# Altium schematic sheet spartan6-1.SchDoc
size 389 x 250 mm; SheetNumber: 2; SheetTotal: 8
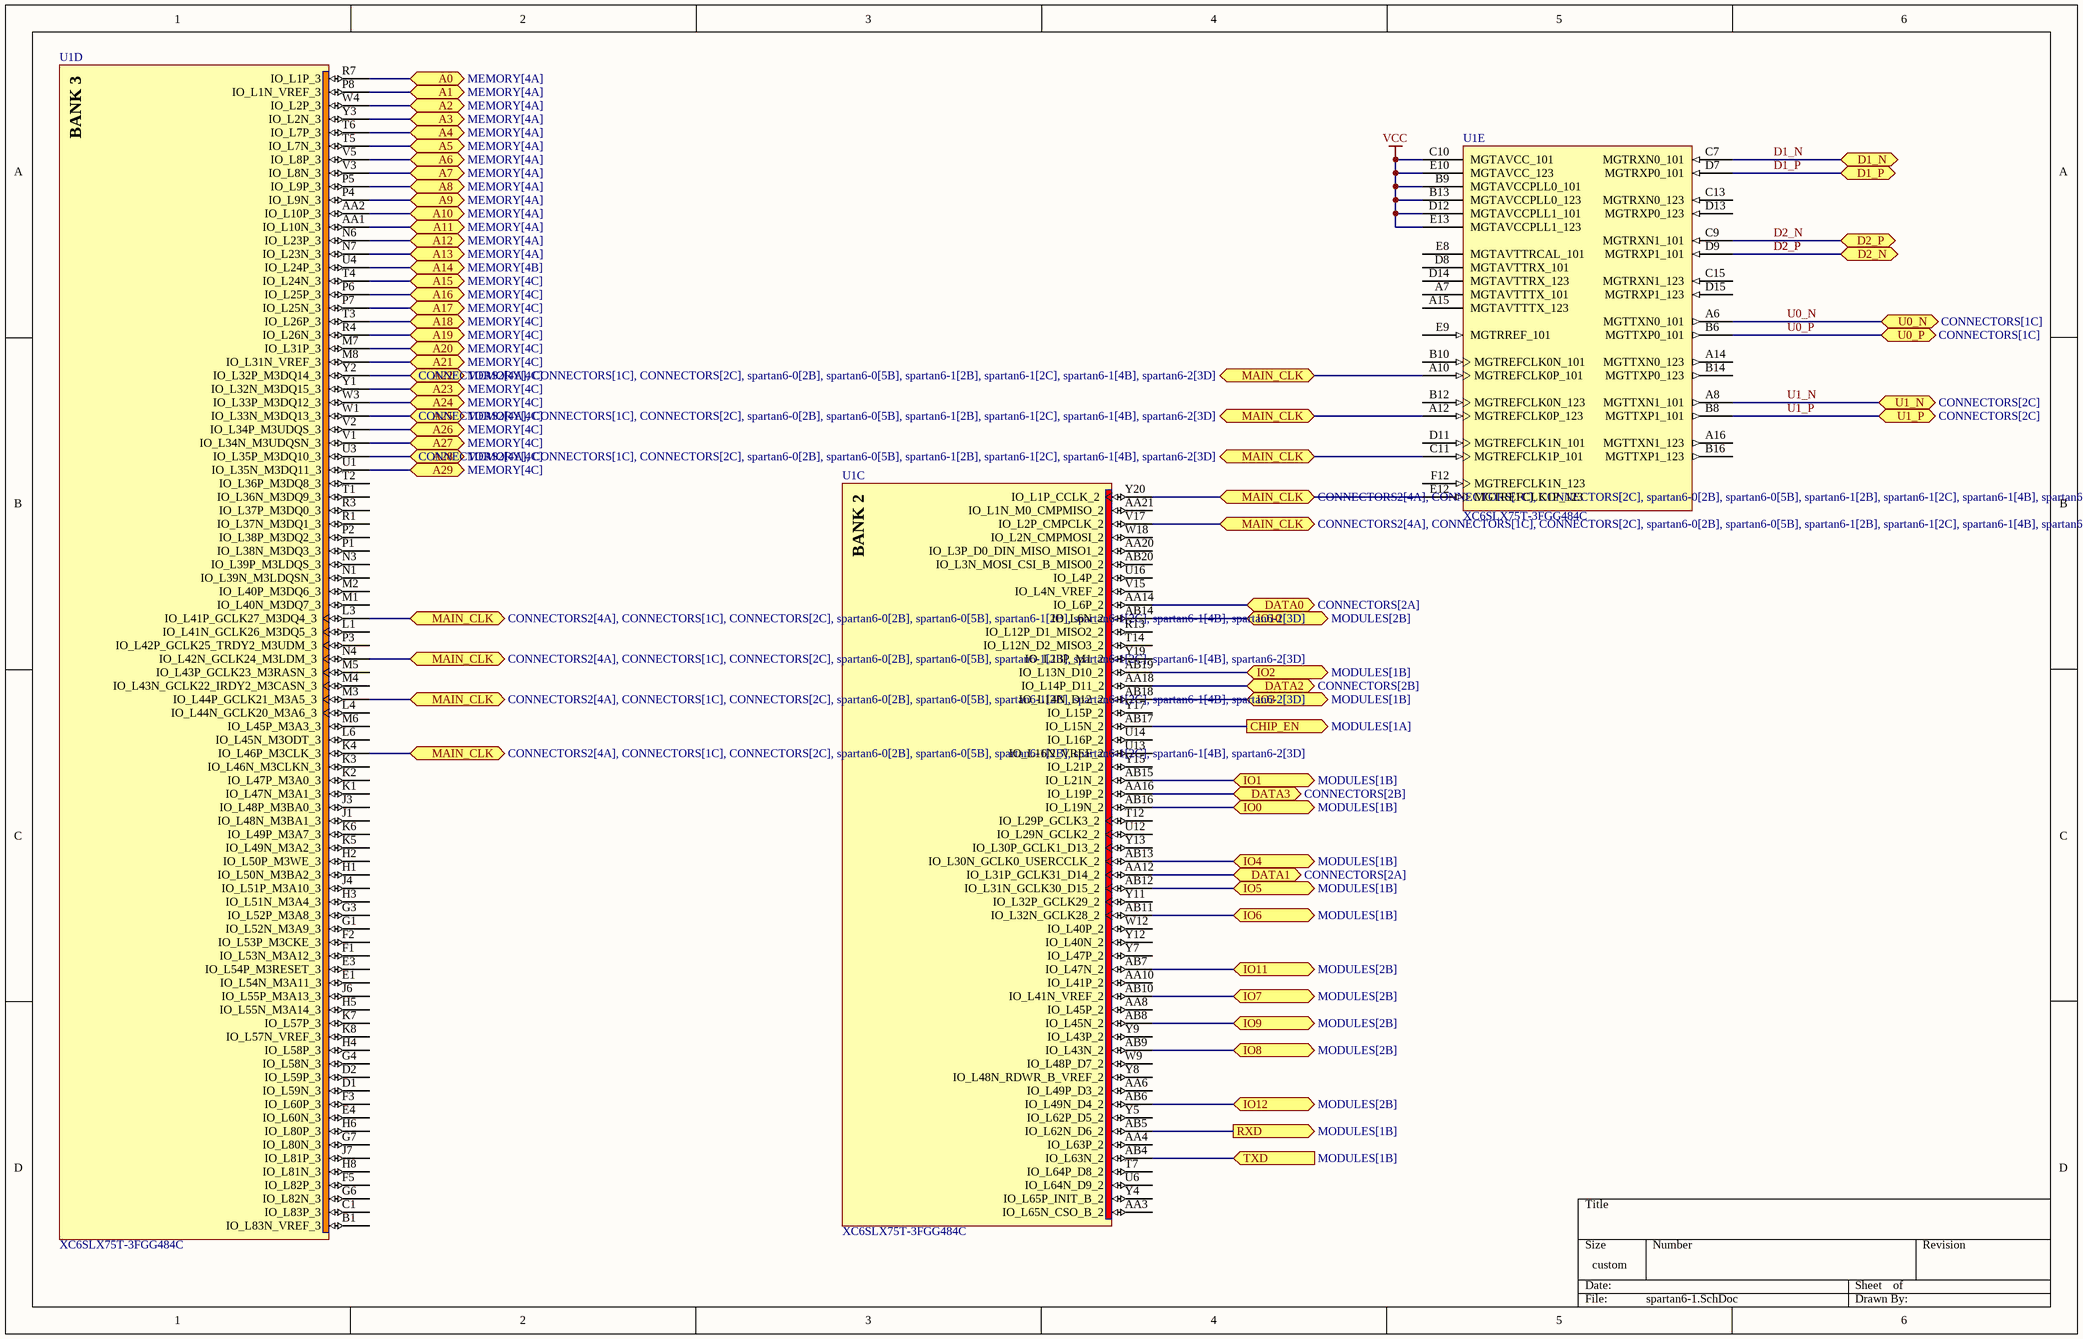
[diagram p0: spartan6-1.SchDoc]

## Parts
U1  XC6SLX75T-3FGG484C  [FGG484]  (parts C,D,E of 9)

## Ports
A0 (bidir, see MEMORY[4A]), A1 (bidir, see MEMORY[4A]), A2 (bidir, see MEMORY[4A]), A3 (bidir, see MEMORY[4A]), A4 (bidir, see MEMORY[4A]), A5 (bidir, see MEMORY[4A]), A6 (bidir, see MEMORY[4A]), A7 (bidir, see MEMORY[4A]), A8 (bidir, see MEMORY[4A]), A9 (bidir, see MEMORY[4A]), A10 (bidir, see MEMORY[4A]), A11 (bidir, see MEMORY[4A]), A12 (bidir, see MEMORY[4A]), A13 (bidir, see MEMORY[4A]), A14 (bidir, see MEMORY[4B]), A15 (bidir, see MEMORY[4C]), A16 (bidir, see MEMORY[4C]), A17 (bidir, see MEMORY[4C]), A18 (bidir, see MEMORY[4C]), A19 (bidir, see MEMORY[4C]), A20 (bidir, see MEMORY[4C]), A21 (bidir, see MEMORY[4C]), A22 (bidir, see MEMORY[4C]), A23 (bidir, see MEMORY[4C]), A24 (bidir, see MEMORY[4C]), A25 (bidir, see MEMORY[4C]), A26 (bidir, see MEMORY[4C]), A27 (bidir, see MEMORY[4C]), A28 (bidir, see MEMORY[4C]), A29 (bidir, see MEMORY[4C]), CHIP_EN (out, see MODULES[1A]), D1_N (bidir), D1_P (bidir), D2_N (bidir), D2_P (bidir), DATA0 (bidir, see CONNECTORS[2A]), DATA1 (bidir, see CONNECTORS[2A]), DATA2 (bidir, see CONNECTORS[2B]), DATA3 (bidir, see CONNECTORS[2B]), IO0 (bidir, see MODULES[1B]), IO1 (bidir, see MODULES[1B]), IO2 (bidir, see MODULES[1B]), IO3 (bidir, see MODULES[1B]), IO4 (bidir, see MODULES[1B]), IO5 (bidir, see MODULES[1B]), IO6 (bidir, see MODULES[1B]), IO7 (bidir, see MODULES[2B]), IO8 (bidir, see MODULES[2B]), IO9 (bidir, see MODULES[2B]), IO10 (bidir, see MODULES[2B]), IO11 (bidir, see MODULES[2B]), IO12 (bidir, see MODULES[2B]), MAIN_CLK (bidir, see CONNECTORS2[4A], CONNECTORS[1C], CONNECTORS[2C], spartan6-0[2B], spartan6-0[5B], spartan6-1[2B], spartan6-1[2C], spartan6-1[4B], spartan6-2[3D]), RXD (out, see MODULES[1B]), TXD (in, see MODULES[1B]), U0_N (bidir, see CONNECTORS[1C]), U0_P (bidir, see CONNECTORS[1C]), U1_N (bidir, see CONNECTORS[2C]), U1_P (bidir, see CONNECTORS[2C])

## Nets
VCC: U1.B9(MGTAVCCPLL0_101) U1.B13(MGTAVCCPLL0_123) U1.C10(MGTAVCC_101) U1.D12(MGTAVCCPLL1_101) U1.E10(MGTAVCC_123) U1.E13(MGTAVCCPLL1_123)
A0: U1.R7(IO_L1P_3) ; port A0
A1: U1.P8(IO_L1N_VREF_3) ; port A1
A2: U1.W4(IO_L2P_3) ; port A2
A3: U1.Y3(IO_L2N_3) ; port A3
A4: U1.T6(IO_L7P_3) ; port A4
A5: U1.T5(IO_L7N_3) ; port A5
A6: U1.V5(IO_L8P_3) ; port A6
A7: U1.V3(IO_L8N_3) ; port A7
A8: U1.P5(IO_L9P_3) ; port A8
A9: U1.P4(IO_L9N_3) ; port A9
A10: U1.AA2(IO_L10P_3) ; port A10
A11: U1.AA1(IO_L10N_3) ; port A11
A12: U1.N6(IO_L23P_3) ; port A12
A13: U1.N7(IO_L23N_3) ; port A13
A14: U1.U4(IO_L24P_3) ; port A14
A15: U1.T4(IO_L24N_3) ; port A15
A16: U1.P6(IO_L25P_3) ; port A16
A17: U1.P7(IO_L25N_3) ; port A17
A18: U1.T3(IO_L26P_3) ; port A18
A19: U1.R4(IO_L26N_3) ; port A19
A20: U1.M7(IO_L31P_3) ; port A20
A21: U1.M8(IO_L31N_VREF_3) ; port A21
A22: U1.Y2(IO_L32P_M3DQ14_3) ; port A22
A23: U1.Y1(IO_L32N_M3DQ15_3) ; port A23
A24: U1.W3(IO_L33P_M3DQ12_3) ; port A24
A25: U1.W1(IO_L33N_M3DQ13_3) ; port A25
A26: U1.V2(IO_L34P_M3UDQS_3) ; port A26
A27: U1.V1(IO_L34N_M3UDQSN_3) ; port A27
A28: U1.U3(IO_L35P_M3DQ10_3) ; port A28
A29: U1.U1(IO_L35N_M3DQ11_3) ; port A29
CHIP_EN: U1.AB17(IO_L15N_2) ; port CHIP_EN
D1_N: U1.C7(MGTRXN0_101) ; port D1_N
D1_P: U1.D7(MGTRXP0_101) ; port D1_P
D2_N: U1.C9(MGTRXN1_101) ; port D2_P
D2_P: U1.D9(MGTRXP1_101) ; port D2_N
DATA0: U1.AA14(IO_L6P_2) ; port DATA0
DATA1: U1.AA12(IO_L31P_GCLK31_D14_2) ; port DATA1
DATA2: U1.AA18(IO_L14P_D11_2) ; port DATA2
DATA3: U1.AA16(IO_L19P_2) ; port DATA3
IO0: U1.AB16(IO_L19N_2) ; port IO0
IO1: U1.AB15(IO_L21N_2) ; port IO1
IO2: U1.AB19(IO_L13N_D10_2) ; port IO2
IO3: U1.AB18(IO_L14N_D12_2) ; port IO3
IO4: U1.AB13(IO_L30N_GCLK0_USERCCLK_2) ; port IO4
IO5: U1.AB12(IO_L31N_GCLK30_D15_2) ; port IO5
IO6: U1.AB11(IO_L32N_GCLK28_2) ; port IO6
IO7: U1.AB10(IO_L41N_VREF_2) ; port IO7
IO8: U1.AB9(IO_L43N_2) ; port IO8
IO9: U1.AB8(IO_L45N_2) ; port IO9
IO10: U1.AB14(IO_L6N_2) ; port IO10
IO11: U1.AB7(IO_L47N_2) ; port IO11
IO12: U1.AB6(IO_L49N_D4_2) ; port IO12
MAIN_CLK: U1.A10(MGTREFCLK0P_101) U1.A12(MGTREFCLK0P_123) U1.C11(MGTREFCLK1P_101) U1.E12(MGTREFCLK1P_123) U1.K4(IO_L46P_M3CLK_3) U1.L3(IO_L41P_GCLK27_M3DQ4_3) U1.M3(IO_L44P_GCLK21_M3A5_3) U1.N4(IO_L42N_GCLK24_M3LDM_3) U1.V17(IO_L2P_CMPCLK_2) U1.Y20(IO_L1P_CCLK_2) ; port MAIN_CLK
RXD: U1.AB5(IO_L62N_D6_2) ; port RXD
TXD: U1.AB4(IO_L63N_2) ; port TXD
U0_N: U1.A6(MGTTXN0_101) ; port U0_N
U0_P: U1.B6(MGTTXP0_101) ; port U0_P
U1_N: U1.A8(MGTTXN1_101) ; port U1_N
U1_P: U1.B8(MGTTXP1_101) ; port U1_P

Not connected (* = marked no-connect by the designer): U1 A7(MGTAVTTTX_101) A14(MGTTXN0_123) A15(MGTAVTTTX_123) A16(MGTTXN1_123) AA3(IO_L65N_CSO_B_2) AA4(IO_L63P_2) AA6(IO_L49P_D3_2) AA8(IO_L45P_2) AA10(IO_L41P_2) AA20(IO_L3P_D0_DIN_MISO_MISO1_2) AA21(IO_L1N_M0_CMPMISO_2) AB20(IO_L3N_MOSI_CSI_B_MISO0_2) B1(IO_L83N_VREF_3) B10(MGTREFCLK0N_101) B12(MGTREFCLK0N_123) B14(MGTTXP0_123) B16(MGTTXP1_123) C1(IO_L83P_3) C13(MGTRXN0_123) C15(MGTRXN1_123) D1(IO_L59N_3) D2(IO_L59P_3) D8(MGTAVTTRX_101) D11(MGTREFCLK1N_101) D13(MGTRXP0_123) D14(MGTAVTTRX_123) D15(MGTRXP1_123) E1(IO_L54N_M3A11_3) E3(IO_L54P_M3RESET_3) E4(IO_L60N_3) E8(MGTAVTTRCAL_101) E9(MGTRREF_101) F1(IO_L53N_M3A12_3) F2(IO_L53P_M3CKE_3) F3(IO_L60P_3) F5(IO_L82P_3) F12(MGTREFCLK1N_123) G1(IO_L52N_M3A9_3) G3(IO_L52P_M3A8_3) G4(IO_L58N_3) G6(IO_L82N_3) G7(IO_L80N_3) H1(IO_L50N_M3BA2_3) H2(IO_L50P_M3WE_3) H3(IO_L51N_M3A4_3) H4(IO_L58P_3) H5(IO_L55N_M3A14_3) H6(IO_L80P_3) H8(IO_L81N_3) J1(IO_L48N_M3BA1_3) J3(IO_L48P_M3BA0_3) J4(IO_L51P_M3A10_3) J6(IO_L55P_M3A13_3) J7(IO_L81P_3) K1(IO_L47N_M3A1_3) K2(IO_L47P_M3A0_3) K3(IO_L46N_M3CLKN_3) K5(IO_L49N_M3A2_3) K6(IO_L49P_M3A7_3) K7(IO_L57P_3) K8(IO_L57N_VREF_3) L1(IO_L41N_GCLK26_M3DQ5_3) L4(IO_L44N_GCLK20_M3A6_3) L6(IO_L45N_M3ODT_3) M1(IO_L40N_M3DQ7_3) M2(IO_L40P_M3DQ6_3) M4(IO_L43N_GCLK22_IRDY2_M3CASN_3) M5(IO_L43P_GCLK23_M3RASN_3) M6(IO_L45P_M3A3_3) N1(IO_L39N_M3LDQSN_3) N3(IO_L39P_M3LDQS_3) P1(IO_L38N_M3DQ3_3) P2(IO_L38P_M3DQ2_3) P3(IO_L42P_GCLK25_TRDY2_M3UDM_3) R1(IO_L37N_M3DQ1_3) R3(IO_L37P_M3DQ0_3) R13(IO_L12P_D1_MISO2_2) T1(IO_L36N_M3DQ9_3) T2(IO_L36P_M3DQ8_3) T7(IO_L64P_D8_2) T12(IO_L29P_GCLK3_2) T14(IO_L12N_D2_MISO3_2) U6(IO_L64N_D9_2) U12(IO_L29N_GCLK2_2) U13(IO_L16N_VREF_2) U14(IO_L16P_2) U16(IO_L4P_2) V15(IO_L4N_VREF_2) W9(IO_L48P_D7_2) W12(IO_L40P_2) W18(IO_L2N_CMPMOSI_2) Y4(IO_L65P_INIT_B_2) Y5(IO_L62P_D5_2) Y7(IO_L47P_2) Y8(IO_L48N_RDWR_B_VREF_2) Y9(IO_L43P_2) Y11(IO_L32P_GCLK29_2) Y12(IO_L40N_2) Y13(IO_L30P_GCLK1_D13_2) Y15(IO_L21P_2) Y17(IO_L15P_2) Y19(IO_L13P_M1_2)

## Notes on the sheet
- (in symbol CMP-0067-00082-1, part C) BANK 2
- (in symbol CMP-0067-00082-1, part D) BANK 3

## Library data of the parts
U1 = CMP-0067-00082-1: Spartan-6 LXT 1.2V FPGA, 268 User I/Os, 484-Ball Fine-Pitch BGA (1.0mm Pitch), Speed Grade 3, Commercial Grade, Pb-Free; PackageDescription: 484-Ball Fine Pitch Ball Grid Array 1.00 mm Pitch (FGG484) - Pb-Free; PackageVersion: ver1.1, Dec-2008; DatasheetVersion: ver1.6, Nov-2010; Code_JEDEC: MS-034-AAJ-1; Code_IPC: BGA100P22X22-484; PackageReference: FGG484